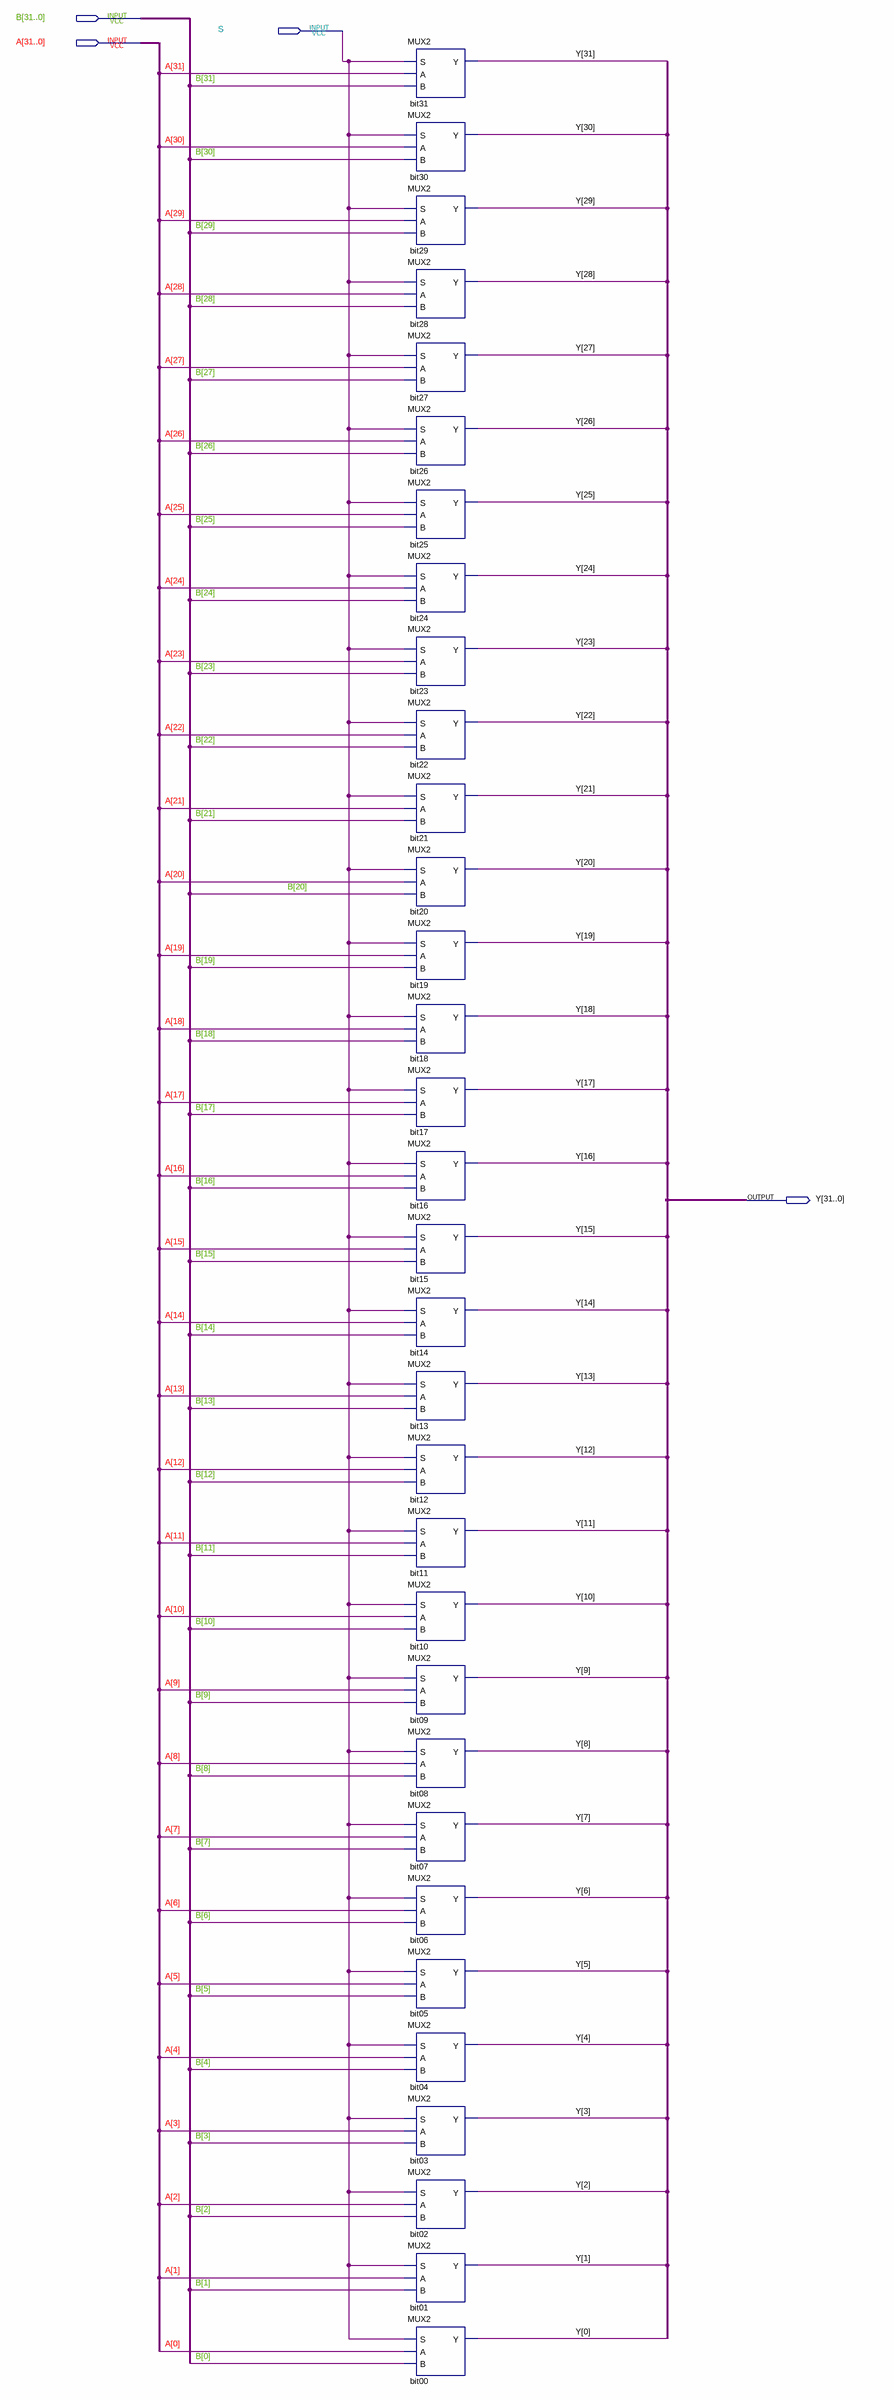
[diagram p0: schematic sheet]
// Quartus schematic MUX2_32.bdf as structural Verilog: 32 symbols, 4 pins
module MUX2_32 (
  input  [31:0] B,
  input  S,
  input  [31:0] A,
  output [31:0] Y
);

  MUX2 bit31 (.S(S), .A(A[31]), .B(B[31]), .Y(Y[31]));
  MUX2 bit30 (.S(S), .A(A[30]), .B(B[30]), .Y(Y[30]));
  MUX2 bit29 (.S(S), .A(A[29]), .B(B[29]), .Y(Y[29]));
  MUX2 bit28 (.S(S), .A(A[28]), .B(B[28]), .Y(Y[28]));
  MUX2 bit27 (.S(S), .A(A[27]), .B(B[27]), .Y(Y[27]));
  MUX2 bit26 (.S(S), .A(A[26]), .B(B[26]), .Y(Y[26]));
  MUX2 bit25 (.S(S), .A(A[25]), .B(B[25]), .Y(Y[25]));
  MUX2 bit24 (.S(S), .A(A[24]), .B(B[24]), .Y(Y[24]));
  MUX2 bit23 (.S(S), .A(A[23]), .B(B[23]), .Y(Y[23]));
  MUX2 bit22 (.S(S), .A(A[22]), .B(B[22]), .Y(Y[22]));
  MUX2 bit21 (.S(S), .A(A[21]), .B(B[21]), .Y(Y[21]));
  MUX2 bit20 (.S(S), .A(A[20]), .B(B[20]), .Y(Y[20]));
  MUX2 bit19 (.S(S), .A(A[19]), .B(B[19]), .Y(Y[19]));
  MUX2 bit18 (.S(S), .A(A[18]), .B(B[18]), .Y(Y[18]));
  MUX2 bit17 (.S(S), .A(A[17]), .B(B[17]), .Y(Y[17]));
  MUX2 bit16 (.S(S), .A(A[16]), .B(B[16]), .Y(Y[16]));
  MUX2 bit15 (.S(S), .A(A[15]), .B(B[15]), .Y(Y[15]));
  MUX2 bit14 (.S(S), .A(A[14]), .B(B[14]), .Y(Y[14]));
  MUX2 bit13 (.S(S), .A(A[13]), .B(B[13]), .Y(Y[13]));
  MUX2 bit12 (.S(S), .A(A[12]), .B(B[12]), .Y(Y[12]));
  MUX2 bit11 (.S(S), .A(A[11]), .B(B[11]), .Y(Y[11]));
  MUX2 bit10 (.S(S), .A(A[10]), .B(B[10]), .Y(Y[10]));
  MUX2 bit09 (.S(S), .A(A[9]), .B(B[9]), .Y(Y[9]));
  MUX2 bit08 (.S(S), .A(A[8]), .B(B[8]), .Y(Y[8]));
  MUX2 bit07 (.S(S), .A(A[7]), .B(B[7]), .Y(Y[7]));
  MUX2 bit06 (.S(S), .A(A[6]), .B(B[6]), .Y(Y[6]));
  MUX2 bit05 (.S(S), .A(A[5]), .B(B[5]), .Y(Y[5]));
  MUX2 bit04 (.S(S), .A(A[4]), .B(B[4]), .Y(Y[4]));
  MUX2 bit03 (.S(S), .A(A[3]), .B(B[3]), .Y(Y[3]));
  MUX2 bit02 (.S(S), .A(A[2]), .B(B[2]), .Y(Y[2]));
  MUX2 bit01 (.S(S), .A(A[1]), .B(B[1]), .Y(Y[1]));
  MUX2 bit00 (.S(S), .A(A[0]), .B(B[0]), .Y(Y[0]));
endmodule
